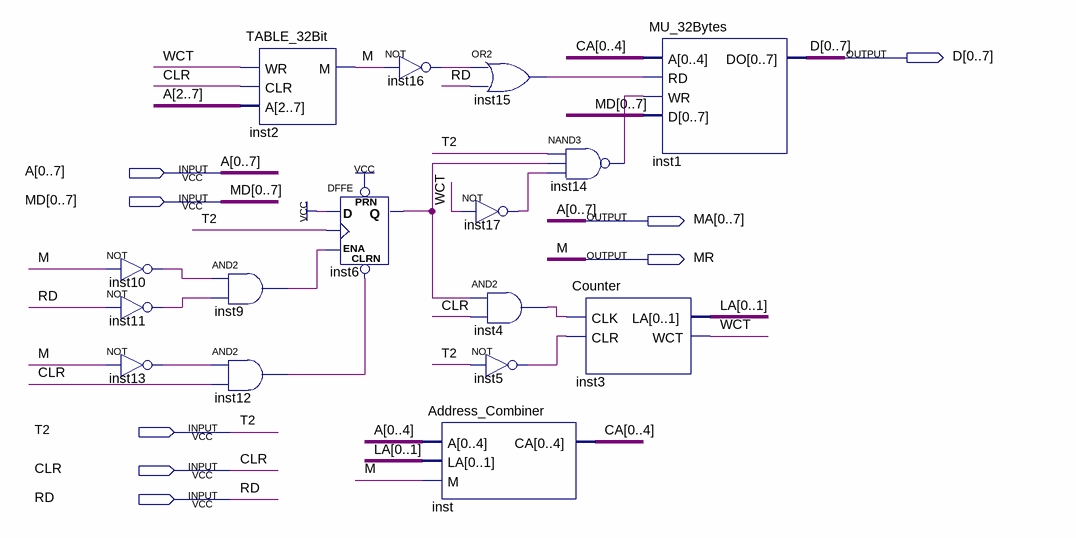
[diagram p0: schematic sheet]
// Quartus schematic Cache2.bdf as structural Verilog: 16 symbols, 8 pins
module Cache2 (
  input  [0:7] A,
  input  [0:7] MD,
  input  T2,
  input  CLR,
  input  RD,
  output [0:7] D,
  output [0:7] MA,
  output MR
);

  wire inst4_out, inst5_out, inst6_q, inst9_out, inst10_out, inst11_out, inst12_out, inst13_out, inst14_out,
       inst15_out, inst16_out, inst17_out, WCT;
  wire [1:0] LA;
  wire [4:0] CA;

  not inst10 (inst10_out, MR);
  not inst11 (inst11_out, RD);
  not inst13 (inst13_out, MR);
  and inst9 (inst9_out, inst10_out, inst11_out);
  and inst12 (inst12_out, inst13_out, CLR);
  TABLE_32Bit inst2 (.WR(WCT), .CLR(CLR), .A(A[2:7]), .M(MR));
  DFFE inst6 (.PRN(1'b1), .CLRN(inst12_out), .D(1'b1), .CLK(T2), .ENA(inst9_out), .Q(inst6_q));
  not inst16 (inst16_out, MR);
  Address_Combiner inst (.A(A[0:4]), .LA({LA[0], LA[1]}), .M(MR), .CA({CA[0], CA[1], CA[2], CA[3], CA[4]}));
  or inst15 (inst15_out, inst16_out, RD);
  not inst17 (inst17_out, WCT);
  and inst4 (inst4_out, inst6_q, CLR);
  not inst5 (inst5_out, T2);
  nand inst14 (inst14_out, T2, inst6_q, inst17_out);
  Counter inst3 (.CLK(inst4_out), .CLR(inst5_out), .LA({LA[0], LA[1]}), .WCT(WCT));
  MU_32Bytes inst1 (.A({CA[0], CA[1], CA[2], CA[3], CA[4]}), .RD(inst15_out), .WR(inst14_out), .D(MD), .DO(D));

  assign MA = A;

  // Other names for the same wires on the sheet: M = MR
endmodule
